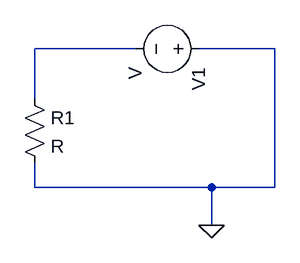
[diagram p0: schematic init_conv.asc]
init_conv.asc, the LTspice schematic file:
Version 4
SHEET 1 880 680
//   x1  y1 x2  y2
WIRE 416 80 288 80
WIRE 592 80 496 80
WIRE 288 144 288 80
WIRE 288 256 288 224
WIRE 512 256 288 256
WIRE 592 256 592 80
WIRE 592 256 512 256
WIRE 512 304 512 256
// ground
//   x  y
FLAG 512 304 0
//     comp    x   y  rot
SYMBOL voltage 512 80 R90
SYMATTR InstName V1
SYMBOL res 272 128 R0
SYMATTR InstName R1

The netlist it stands for:
* init_conv.asc
V1 0 N001 V
R1 N001 0 R
.backanno
.end